# EAGLE schematic mini-hotkeyboard-schematic (EAGLE 9.6.0)
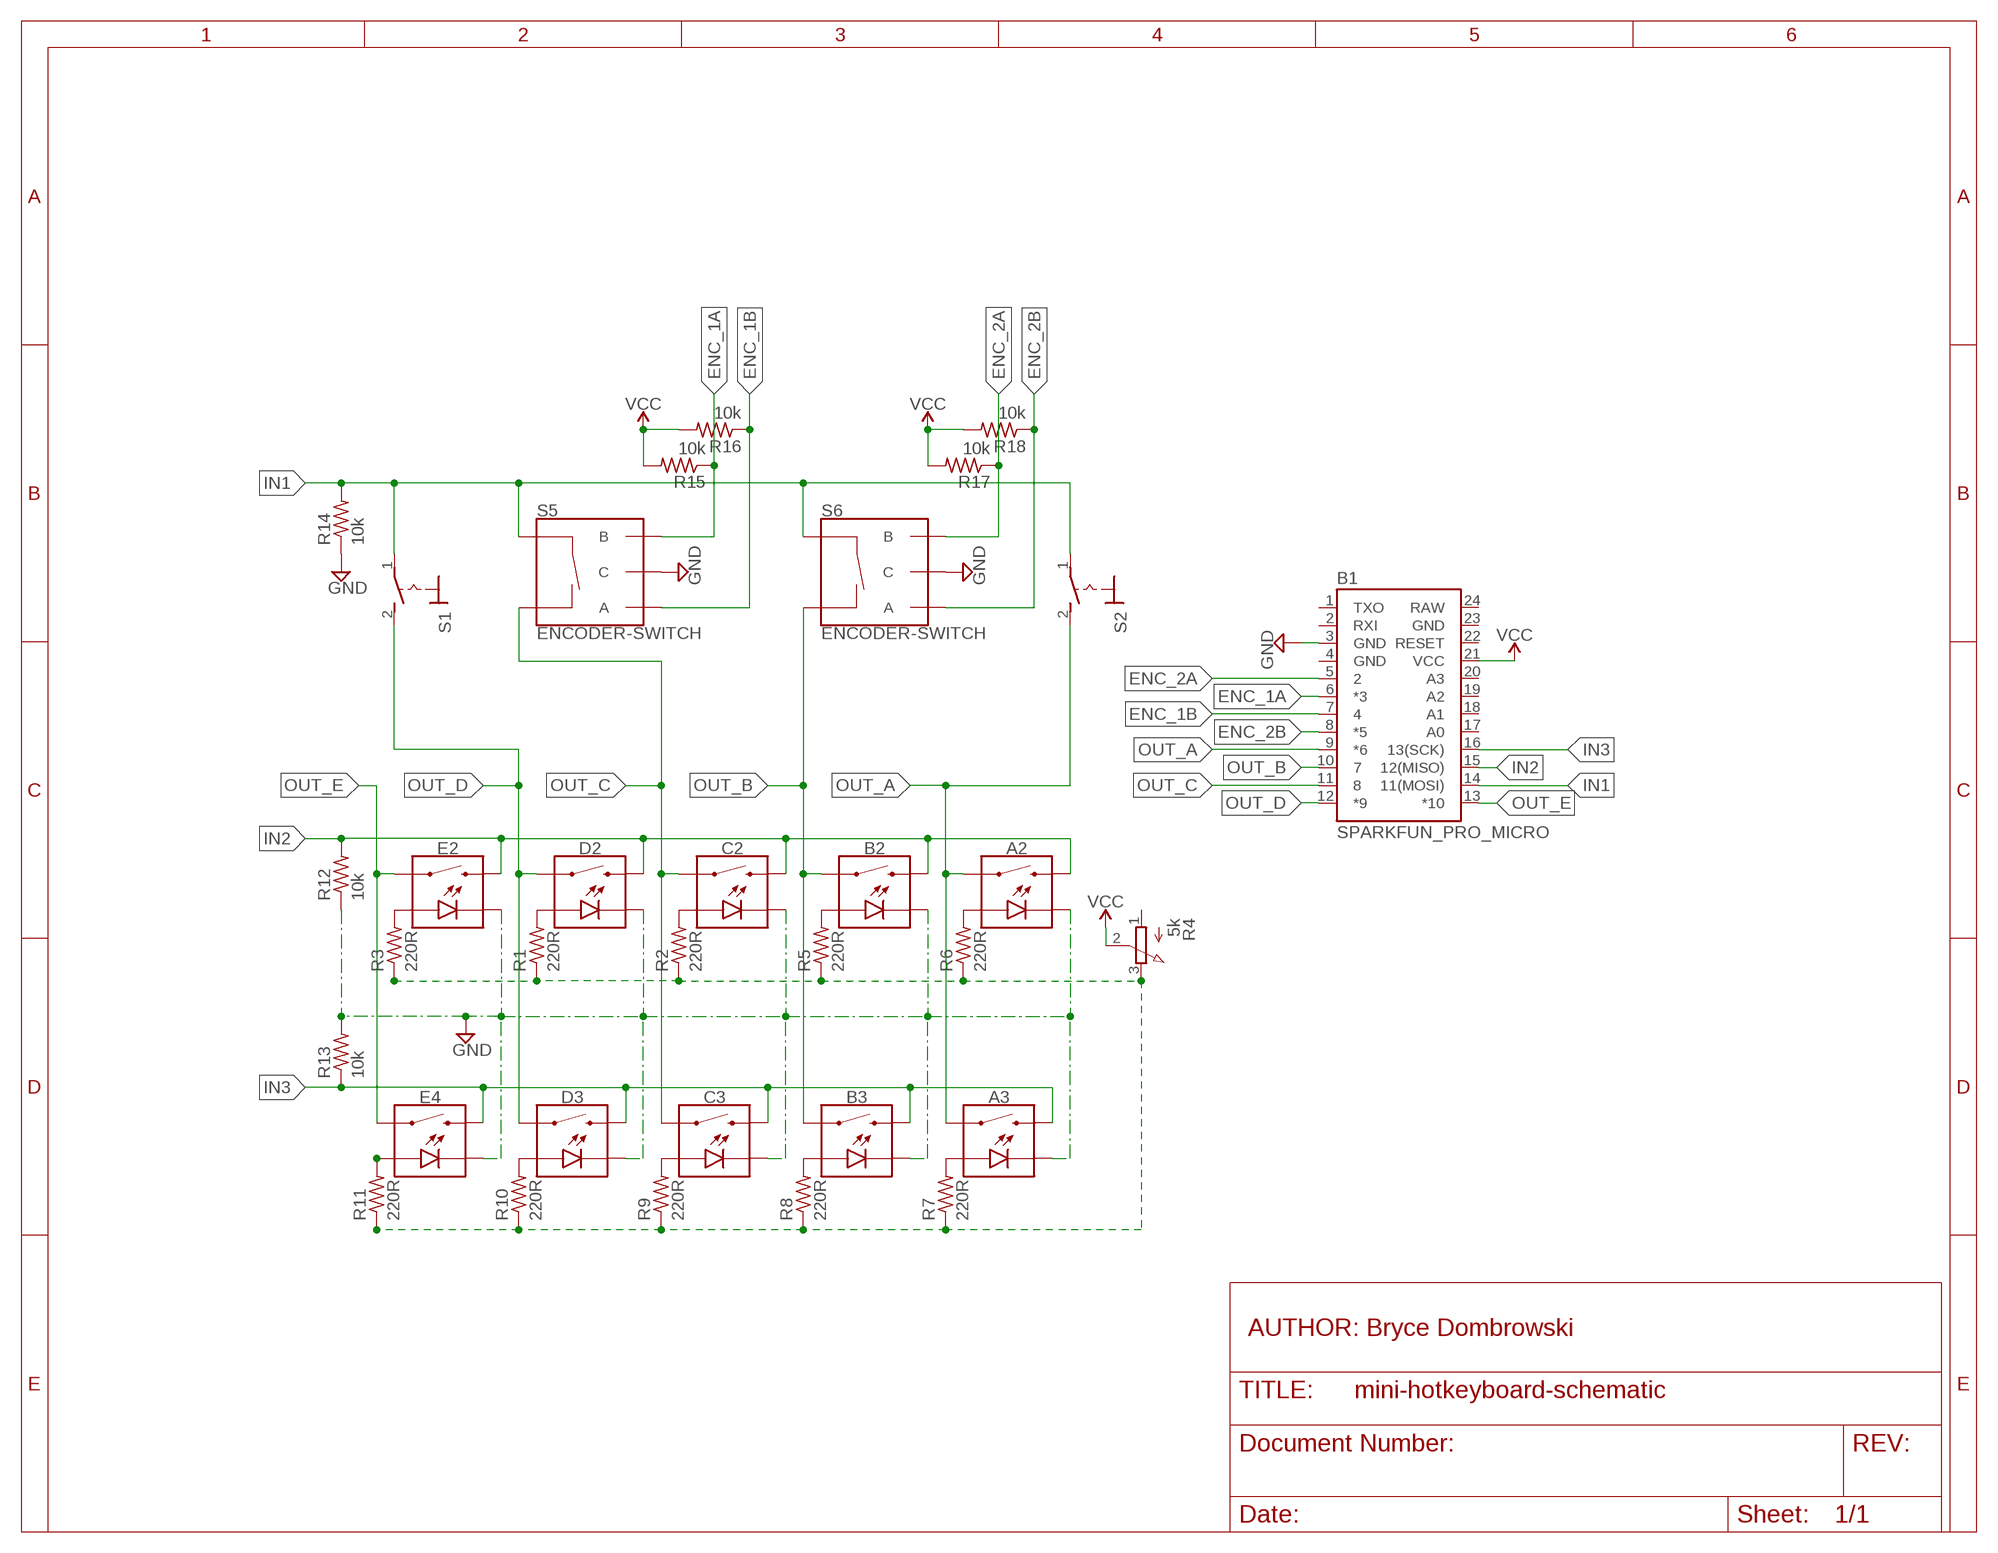
[diagram p0: schematic, sheet 1]

## Parts
A2  MOMENTARY-SWITCH-SPST-LED-PTH-CHERRY  [CHERRY-MX-LED]
A3  MOMENTARY-SWITCH-SPST-LED-PTH-CHERRY  [CHERRY-MX-LED]
B1  SPARKFUN_PRO_MICRO  [SPARKFUN_PRO_MICRO]
B2  MOMENTARY-SWITCH-SPST-LED-PTH-CHERRY  [CHERRY-MX-LED]
B3  MOMENTARY-SWITCH-SPST-LED-PTH-CHERRY  [CHERRY-MX-LED]
C2  MOMENTARY-SWITCH-SPST-LED-PTH-CHERRY  [CHERRY-MX-LED]
C3  MOMENTARY-SWITCH-SPST-LED-PTH-CHERRY  [CHERRY-MX-LED]
D2  MOMENTARY-SWITCH-SPST-LED-PTH-CHERRY  [CHERRY-MX-LED]
D3  MOMENTARY-SWITCH-SPST-LED-PTH-CHERRY  [CHERRY-MX-LED]
E2  MOMENTARY-SWITCH-SPST-LED-PTH-CHERRY  [CHERRY-MX-LED]
E4  MOMENTARY-SWITCH-SPST-LED-PTH-CHERRY  [CHERRY-MX-LED]
R1  220R  R-US_0411/3V  [0411V]
R2  220R  R-US_0411/3V  [0411V]
R3  220R  R-US_0411/3V  [0411V]
R4  5k  3RP/1610N  [3RP/1610N]
R5  220R  R-US_0411/3V  [0411V]
R6  220R  R-US_0411/3V  [0411V]
R7  220R  R-US_0411/3V  [0411V]
R8  220R  R-US_0411/3V  [0411V]
R9  220R  R-US_0411/3V  [0411V]
R10  220R  R-US_0411/3V  [0411V]
R11  220R  R-US_0411/3V  [0411V]
R12  10k  R-US_0411/3V  [0411V]
R13  10k  R-US_0411/3V  [0411V]
R14  10k  R-US_0411/3V  [0411V]
R15  10k  R-US_0411/3V  [0411V]
R16  10k  R-US_0411/3V  [0411V]
R17  10k  R-US_0411/3V  [0411V]
R18  10k  R-US_0411/3V  [0411V]
S1  MS243  [MS243]
S2  MS243  [MS243]
S5  ENCODER-SWITCH  [ROTARY_ENC_PLAIN]
S6  ENCODER-SWITCH  [ROTARY_ENC_PLAIN]

## Nets
ENC_1A: B1.6(*3) R15.1 S5.B
ENC_1B: B1.7 R16.1 S5.A
ENC_2A: B1.5 R17.1 S6.B
ENC_2B: B1.8(*5) R18.1 S6.A
GND: A2.K(C) A3.K(C) B1.3(GND) B2.K(C) B3.K(C) C2.K(C) C3.K(C) D2.K(C) D3.K(C) E2.K(C) E4.K(C) R12.1 R13.2 R14.1 S5.C S6.C
IN1: B1.14(11(MOSI)) R14.2 S1.1(P) S2.1(P) S5.SW+ S6.SW+
IN2: A2.S2 B1.15(12(MISO)) B2.S2 C2.S2 D2.S2 E2.S2 R12.2
IN3: A3.S2 B1.16(13(SCK)) B3.S2 C3.S2 D3.S2 E4.S2 R13.1
N$2: D2.A R1.2
N$3: E2.A R3.2
N$4: E4.A R11.2
N$5: R1.1 R2.1 R3.1 R4.3(E) R5.1 R6.1 R7.1 R8.1 R9.1 R10.1 R11.1
N$6: C2.A R2.2
N$8: B2.A R5.2
N$10: A2.A R6.2
N$12: A3.A R7.2
N$14: B3.A R8.2
N$16: C3.A R9.2
N$18: D3.A R10.2
OUT_A: A2.S1 A3.S1 B1.9(*6) S2.2(S)
OUT_B: B1.10 B2.S1 B3.S1 S6.SW-
OUT_C: B1.11 C2.S1 C3.S1 S5.SW-
OUT_D: B1.12(*9) D2.S1 D3.S1 S1.2(S)
OUT_E: B1.13(*10) E2.S1 E4.S1
VCC: B1.21(VCC) R4.2(S) R15.2 R16.2 R17.2 R18.2
Unconnected: B1.1(TXO) B1.2(RXI) B1.17(A0) B1.18(A1) B1.19(A2) B1.20(A3) B1.22(RESET) R4.1(A)

## Notes on the sheet
- AUTHOR: Bryce Dombrowski

## Power pins joined to a net without a drawn wire
GND: B1.4(GND) B1.23(GND)
RAW: B1.24(RAW)

## Library data of the parts
A2 A3 B2 B3 C2 C3 D2 D3 E2 E4 = SparkFun-Switches:MOMENTARY-SWITCH-SPST-LED: Momentary Switch (Pushbutton) - SPST - w/ LED Normally-open (NO) SPST momentary switches (buttons, pushbuttons), with a built-in LED. Variants PTH-CHERRY - Cherry MX Switch Cherry MX Keyswitches are top-of-the-line mechanical keyboard switches. They’re satisfyingly “clicky”, reliable up to tens-of-millions of key presses, and a standard in gaming and programming keyboards across the globe. This ‘blue’ version Cherry MX Switch is favored by most due to its secondary internal actuator making it less likely to “double-tap.” If you are looking for a noticeably audible and high-quality key switch, this is the perfect option for you! Cherry MX Switch <https://www.sparkfun.com/products/13834> (COM-13834) Cherry MX Switch Breakout <https://www.sparkfun.com/products/13773> (BOB-13773) PTH-12MM and PTH-12MM-KIT - 12mm Illuminated LED KIT variant is for soldering kits. There is no tStop (covering up the top side of the pads with mask). This helps the beginner see which side they should be soldering too. LED Tactile Button Breakout <https://www.sparkfun.com/products/10467> (BOB-10467) LED Tactile Button - Red <https://www.sparkfun.com/products/10442> (COM-10442) LED Tactile Button - Blue <https://www.sparkfun.com/products/10443> (COM-10443) LED Tactile Button - Green <https://www.sparkfun.com/products/10440> (COM-10440) LED Tactile Button - Orange <https://www.sparkfun.com/products/10441> (COM-10441) LED Tactile Button - White <https://www.sparkfun.com/products/10439> (COM-10439); SF_ID: COM-13834
B1 = SparkFun-Boards:SPARKFUN_PRO_MICRO: SparkFun Pro Micro Atmega32U4 compatible footprint. SparkFun Products: 3.3V/8MHz <https://www.sparkfun.com/products/12587> 5V/16MHz <https://www.sparkfun.com/products/12640>
R1-R3 R5-R18 = adafruit:R-US_: RESISTOR, American symbol
R4 = pot:3RP/1610N: 16mm Potentiometer one level Source: http://www.alphapotentiometers.net/html/16mm_pot_2.html
S1 S2 = switch:MS243: TOGGLE SWITCH
S5 S6 = SparkFun-Switches:ENCODER-SWITCH: Rotary Encoder w/ Select Switch Encoders rotate similarly to potentiometers, but they’re different from potentiometers in that an encoder has full rotation without limits. They output gray code so that you can tell how much and in which direction the encoder has been turned. This encoder includes a push-down select switch built into the shaft. SparkFun Products Rotary Encoder <https://www.sparkfun.com/products/9117> (COM-09117); SF_SKU: COM-09117